# Altium schematic sheet CP2102_UART.SchDoc: CP2102_UART
size A4; Author: LanTruong; CompanyName: Gremsy J.S.C; Organization: Altium Limited; Address1: 152-154 Street No. 02, Van Phuc Residential City,; Address2: Hiep Binh Phuoc Ward, Thu Duc City, HCM City,; Address3: Viet Nam; DocumentNumber: 002; Revision: A; SheetNumber: 2; SheetTotal: 2
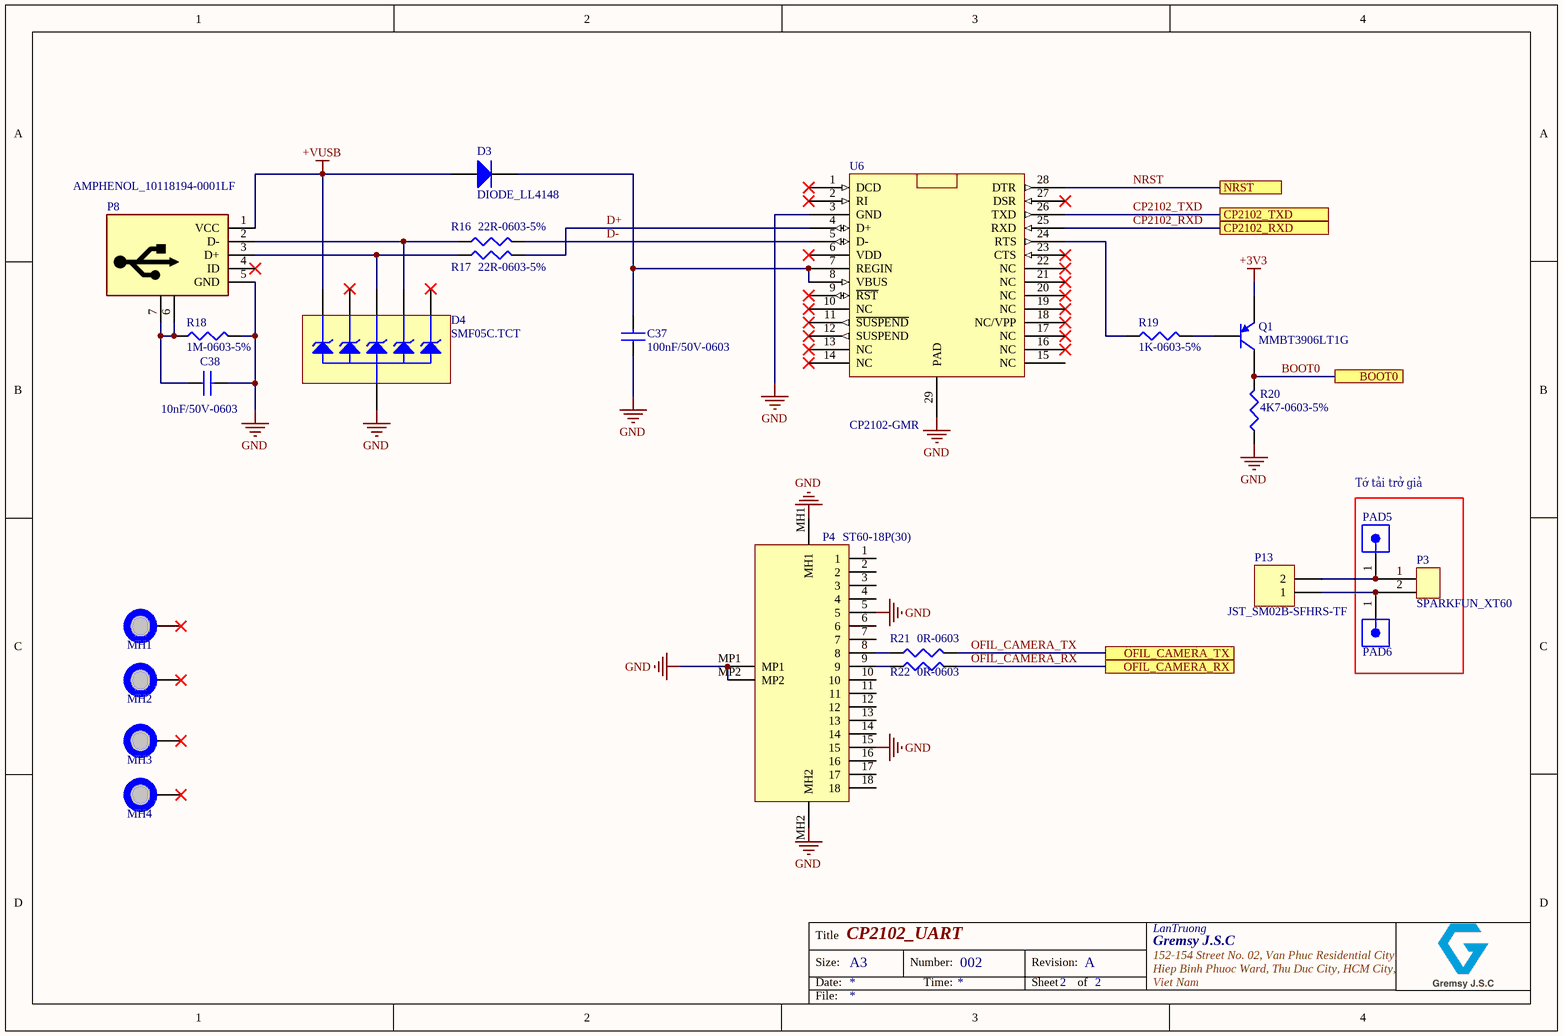
[diagram p0: CP2102_UART.SchDoc]

## Parts
C37  100nF/50V-0603  [CAP0603]
C38  10nF/50V-0603  [CAP0603]
D3  DIODE_LL4148  [SOD80]
D4  SMF05C.TCT  [SC-88]
MH1  MH_3MMC_2.1MMD  [MH_3MMD_2.1MMD]  (value not drawn)  (no BOM)
MH2  MH_3MMC_2.1MMD  [MH_3MMD_2.1MMD]  (value not drawn)  (no BOM)
MH3  MH_3MMC_2.1MMD  [MH_3MMD_2.1MMD]  (value not drawn)  (no BOM)
MH4  MH_3MMC_2.1MMD  [MH_3MMD_2.1MMD]  (value not drawn)  (no BOM)
P3  SPARKFUN_XT60  [XT60_MALE_RA]
P4  ST60-18P(30)  [ST6018P30]
P8  AMPHENOL_10118194-0001LF  [USB-B-Micro_10118194-0001LF]
P13  JST_SM02B-SFHRS-TF  [JST_M02B-SFHRS-TF(LF)(SN)]
PAD5  PAD_2.5MM_1.5MM  [PAD_2.5MM_1.5MM_HOLE]  (value not drawn)  (no BOM)
PAD6  PAD_2.5MM_1.5MM  [PAD_2.5MM_1.5MM_HOLE]  (value not drawn)  (no BOM)
Q1  MMBT3906LT1G  [SOT23]
R16  22R-0603-5%  [RES0603]
R17  22R-0603-5%  [RES0603]
R18  1M-0603-5%  [RES0603]
R19  1K-0603-5%  [RES0603]
R20  4K7-0603-5%  [RES0603]
R21  0R-0603  [RES0603]
R22  0R-0603  [RES0603]
U6  CP2102-GMR  [QFN28-Pitch 0.5 mm]

## Blocks framed on the sheet
Tớ tải trở giả: P3 PAD5 PAD6

## Ports
BOOT0, CP2102_RXD, CP2102_TXD, NRST, OFIL_CAMERA_RX, OFIL_CAMERA_TX

## Nets
+3V3: Q1.2(E)
+VUSB: D3.1(A) D4.1 P8.1(VCC)
GND: C37.1 C38.2 D4.2 P4.5 P4.15 P4.MH1 P4.MH2 P4.MP1 P4.MP2 P8.5(GND) R18.2 R20.1 U6.3(GND) U6.29(PAD)
BOOT0: Q1.3(C) R20.2 ; port BOOT0
CP2102_RXD: U6.25(RXD) ; port CP2102_RXD
CP2102_TXD: U6.26(TXD) ; port CP2102_TXD
D+: R17.2 U6.4(D+)
D-: R16.2 U6.5(D-)
NRST: U6.28(DTR) ; port NRST
OFIL_CAMERA_RX: R22.2 ; port OFIL_CAMERA_RX
OFIL_CAMERA_TX: R21.2 ; port OFIL_CAMERA_TX
NetC37_2: C37.2 D3.2(K) U6.7(REGIN) U6.8(VBUS)
NetC38_1: C38.1 P8.6(SHIELD) P8.7(SHIELD) R18.1
NetD4_4: D4.4 P8.3(D+) R17.1
NetD4_5: D4.5 P8.2(D-) R16.1
NetP3_1: P3.1 P13.2 PAD5.1
NetP3_2: P3.2 P13.1 PAD6.1
NetP4_8: P4.8 R21.1
NetP4_9: P4.9 R22.1
NetQ1_1: Q1.1(B) R19.2
NetR19_1: R19.1 U6.24(RTS)

Not connected (* = marked no-connect by the designer): D4 3* 6*; MH1 1*; MH2 1*; MH3 1*; MH4 1*; P4 1 2 3 4 6 7 10 11 12 13 14 16 17 18; P8 4(ID)*; U6 1(DCD)* 2(RI)* 6(VDD)* 9(~{RST})* 10(NC)* 11(~{SUSPEND})* 12(SUSPEND)* 13(NC)* 14(NC)* 15(NC) 16(NC)* 17(NC)* 18(NC/VPP)* 19(NC)* 20(NC)* 21(NC)* 22(NC)* 23(CTS)* 27(DSR)*

## Notes on the sheet
- Title
- Size:
- Date:
- A3
- Number:
- Time:
- Revision:
- Sheet
- of
- File:

## Library data of the parts
C37 = CAP_100nF/50V-0603-10%: CAP CER 0.1UF 50V X7R 0603; Manufacturer 1: Yageo; MfrP/N: CC0603KRX7R9BB104; Tolerance: ±10%; Value: 100nF; GremsyP/N: 102-100n-005-0; Supplier 1: Digi-Key; Supplier Part Number 1: 311-1344-1-ND; Voltage - Rated: 50V; Package / Case: 0603 (1608 Metric); ComponentLink1URL: http://www.yageo.com/documents/recent/UPY-GPHC_X7R_6.3V-to-50V_18.pdf; ComponentLink1Description: http://www.yageo.com/documents/recent/UPY-GPHC_X7R_6.3V-to-50V_18.pdf
C38 = CAP_10nF/50V-0603-10%: CAP CER 10000PF 50V X7R 0603; Manufacturer 1: Yageo; MfrP/N: CC0603KRX7R9BB103; Tolerance: ±10%; Value: 10nF; GremsyP/N: 102-10n-0030; Supplier 1: Digi-Key; Supplier Part Number 1: 311-1085-1-ND; Voltage - Rated: 50V; Package / Case: 0603 (1608 Metric); ComponentLink1URL: http://www.yageo.com/documents/recent/UPY-GPHC_X7R_6.3V-to-50V_18.pdf; ComponentLink1Description: http://www.yageo.com/documents/recent/UPY-GPHC_X7R_6.3V-to-50V_18.pdf
D3 = DIODE-RECTIFIER_LL4148: DIODE GEN PURP 100V 200MA SOD80; Manufacturer: Fairchild/ON Semiconductor; MfrP/N: LL4148; Diode Type: Standard; Voltage - Forward (Vf) (Max) @ If: 1V @ 10mA; Speed: Small Signal =< 200mA (Io), Any Speed; Current - Reverse Leakage @ Vr: 25nA @ 20V; Capacitance @ Vr, F: 4pF @ 0V, 1MHz; GremsyP/N: 104-RECT-002-0; Supplier 1: Digi-Key; RoHS: RoHS Compliant; Category: Discrete Semiconductor Products; Stock 1: 494912; Pricing 1: 1=0.1, 10=0.095, 100=0.0518, 500=0.03188, 1000=0.02174 (USD); Packaging: Cut Tape (CT); Part Status: Active; Current - Average Rectified (Io): 200mA; Mounting Type: Surface Mount; Package / Case: DO-213AC, MINI-MELF, SOD-80; Supplier Device Package: SOD-80; Operating Temperature - Junction: -55°C ~ 175°C; ComponentLink1URL: https://www.fairchildsemi.com/datasheets/LL/LL4148.pdf; ComponentLink1Description: https://www.fairchildsemi.com/datasheets/LL/LL4148.pdf; Supplier Part Number 1: LL4148FSCT-ND
D4 = DIODE-ESD_SMF05C.TCT: TVS DIODE 5VWM 12.5VC SC70-6; Manufacturer 1: Semtech Corporation; Category 1: Circuit Protection; Type: Zener; Voltage - Reverse Standoff (Typ): 5V (Max); Voltage - Breakdown (Min): 6V; Voltage - Clamping (Max) @ Ipp: 12.5V; Current - Peak Pulse (10/1000µs): 8A (8/20µs); Power - Peak Pulse: 100W; Power Line Protection: No; Capacitance @ Frequency: 130pF @ 1MHz; GremsyP/N: 104-ESD-010-0; Supplier 1: Digi-Key; Supplier Part Number 1: SMF05CCT-ND; MfrP/N: SMF05C.TCT; RoHS 1: RoHS Compliant; Description 1: TVS DIODE 5VWM 12.5VC SC70-6; Stock 1: 35242; Pricing 1: 1=0.87, 10=0.757, 25=0.6704, 100=0.584, 250=0.50832, 500=0.4326, 1000=0.34608 (USD); Packaging: Cut Tape (CT); Part Status: Active; Applications: General Purpose; Operating Temperature: -55°C ~ 125°C (TJ); Mounting Type: Surface Mount; Package / Case: 6-TSSOP, SC-88, SOT-363; Supplier Device Package: SC-70-6; ComponentLink1URL: http://www.semtech.com/images/datasheet/smf05c.pdf; ComponentLink1Description: http://www.semtech.com/images/datasheet/smf05c.pdf; Manufacturer Part Number: SMF05C.TCT
MH1-MH4 = MH_3MMC_2.1MMD: Mounting Hole 3mm Diameter, 2.1mm Drill
P3 = CON-SPARKFUN_XT60: CON XT-60, MALE PIN, THROUGH HOLE, 500V, 30A; Manufacturer: SparkFun Electronics; GremsyP/N: 106-SPARKFUN-001; MfrP/N: XT-60
P4 = CON-HIROSE_ST60-18P(30): HEADER 18POS PITCH 0.5MM, SMD, ST, FEMALE; Manufacturer 1: Hirose; Description 1: Interface Connectors for Portable Terminal Devices, -30 to 80 ℃, RoHS; Category 1: Connectors; Connector Type: Receptacle,Non-Gendered; Number of Positions: 18; Gender: Receptacle; Current Rating: 500mA; Pitch: 0.02inch; Supplier 1: Digi-Key; Supplier Part Number 1: H125265CT-ND; Manufacturer Part Number 1: ST60-18P(30); RoHS 1: Yes; Stock 1: 33582; Pricing 1: 1=1.60000, 10=1.45500, 25=1.36640, 50=1.30680, 100=1.24740, 250=1.12860, 500=1.03950 (USD); Mount: Surface Mount; Number of Pins: 18; Color: Black; Contact Material: Copper Alloy; Contact Plating: Gold; Packaging: Tape and Reel; Number of Rows: 1; Termination: Solder; REACH SVHC: Unknown; Flammability Rating: UL94 V-0; Lead Free: Lead Free; RoHS Compliant: Yes; ComponentLink1URL: http://www.farnell.com/datasheets/691909.pdf?src-supplier=Element14; ComponentLink1Description: http://www.farnell.com/datasheets/691909.pdf?src-supplier=Element14; ComponentLink2URL: https://www.hirose.com/product/en/download_file/key_name/ST/category/Catalog/doc_file_id/49740/?file_category_id=4&item_id=161&is_series=1&src-supplier=Digi-Key; ComponentLink2Description: https://www.hirose.com/product/en/download_file/key_name/ST/category/Catalog/doc_file_id/49740/?file_category_id=4&item_id=161&is_series=1&src-supplier=Digi-Key
P8 = CON-AMPHENOL_10118194-0001LF: USB2.0 MICRO_5POS-RA-SMD-F-AM, FEMALE; Manufacturer 1: Amphenol FCI; Description 1: CONN USB MICRO B RECPT SMT R/A; Category 1: Connectors, Interconnects; Connector Type: USB - micro B; Number of Contacts: 5; Gender: Receptacle; GremsyP/N: 106-AMPHENOL-008; Number of Ports: 1; Current Rating: 1.8A per Contact; Voltage - Rated: 100VAC; Shielding: Shielded; Supplier 1: Digi-Key; Supplier Part Number 1: 609-4618-1-ND; MfrP/N: 10118194-0001LF; RoHS 1: RoHS Compliant; Stock 1: 208581; Pricing 1: 1=0.46, 10=0.437, 25=0.3744, 50=0.318, 100=0.3056, 250=0.27444, 500=0.26196 (USD); Packaging: Cut Tape (CT); Part Status: Active; Specifications: USB 2.0; Mounting Type: Surface Mount, Right Angle; Through Hole; Mounting Feature: Horizontal; Termination: Solder; Features: Solder Retention; Operating Temperature: -30°C ~ 80°C; Contact Finish: Gold; Shell/Shielding Material: Steel, Stainless; ComponentLink1URL: http://portal.fciconnect.com/Comergent//fci/drawing/10118194.pdf; ComponentLink1Description: http://portal.fciconnect.com/Comergent//fci/drawing/10118194.pdf
P13 = CON-JST_SM02B-SFHRS-TF: PWR_2POS-P1.8-RA-SMD-M; Manufacturer: JST; MfrP/N: SM02B-SFHRS-TF(LF)(SN); Number of Positions: 2; Gender: Male; Connector Type: Male Pin; Pitch: 0.071inch; GremsyP/N: 106-JST-039; Supplier 1: Digi-Key; Stock 1: 73385; Pricing 1: 1=0.7, 10=0.653, 100=0.5006, 500=0.4353, 1000=0.3591 (USD); Mount: Surface Mount; Colour: Red; Contact Material: Copper; Contact Plating: Tin; Number of Rows: 1; Packaging: Cut Tape; Fastening Type: Detent; Number of Contacts: 2; REACH SVHC: Unknown; Lead Free: Lead Free; Supplier Part Number 1: 455-2524-6-ND; Termination: Solder
PAD5 PAD6 = PAD_2.5MMC_1.5MMD_HOLE
Q1 = TRNS-PNP_MMBT3906LT1G: TRANS PNP 40V 0.2A SOT23; Manufacturer 1: ON Semiconductor; Manufacturer Size Code: A; Category 1: Discrete Semiconductor Products; Current - Collector (Ic) (Max): 200mA; Vce Saturation (Max) @ Ib, Ic: 400mV @ 5mA, 50mA; DC Current Gain (hFE) (Min) @ Ic, Vce: 100 @ 10mA, 1V; Power - Max: 300mW; Frequency - Transition: 250MHz; Description 2: CAP TANT 10UF 10V 10% 1206; Category 2: Capacitors; Capacitance: 10µF; Tolerance: ±10%; Voltage - Rated: 10V; Type: Molded; ESR (Equivalent Series Resistance): 2 Ohm; GremsyP/N: 109-PNP-001-0; Supplier 1: Digi-Key; Supplier Part Number 1: MMBT3906LT1GOSDKR-ND; MfrP/N: MMBT3906LT1G; RoHS 1: RoHS Compliant; Description 1: TRANS PNP 40V 0.2A SOT23; Stock 1: 104972; Pricing 1: 1=0.11, 10=0.105, 100=0.0569, 500=0.03504, 1000=0.02389 (USD); Packaging: Digi-Reel®; Part Status: Active; Transistor Type: PNP; Voltage - Collector Emitter Breakdown (Max): 40V; Current - Collector Cutoff (Max): -; Operating Temperature: -55°C ~ 150°C (TJ); Mounting Type: Surface Mount; Package / Case: TO-236-3, SC-59, SOT-23-3; Supplier Device Package: SOT-23-3 (TO-236); ComponentLink1URL: http://www.onsemi.com/pub_link/Collateral/MMBT3906LT1-D.PDF; ComponentLink1Description: http://www.onsemi.com/pub_link/Collateral/MMBT3906LT1-D.PDF; Supplier 2: Digi-Key; Supplier Part Number 2: 718-1969-1-ND; Manufacturer 2: Vishay Sprague; Manufacturer Part Number 2: 593D106X9010A2TE3; RoHS 2: RoHS Compliant; Stock 2: 5789; Pricing 2: 1=0.5, 10=0.344, 100=0.2065, 500=0.15486, 1000=0.13077 (USD); Lifetime @ Temp.: -; Size / Dimension: 0.126" L x 0.063" W (3.20mm x 1.60mm); Height - Seated (Max): 0.071" (1.80mm); Lead Spacing: -; Features: General Purpose; Failure Rate: -; ComponentLink2URL: http://www.vishay.com/docs/40005/593d.pdf; ComponentLink2Description: http://www.vishay.com/docs/40005/593d.pdf; Manufacturer Part Number: MMBT3906LT1G
R16 R17 = RES_22R-0603-5%: RES 22 OHM 5% 1/10W 0603; Manufacturer 1: Yageo; MfrP/N: RC0603JR-0722RL; Value: 22R; GremsyP/N: 101-22R-002-0; Supplier 1: Digi-Key; Supplier Part Number 1: 311-22GRCT-ND; Package / Case: 0603 (1608 Metric); Tolerance: ±5%
R18 = RES_1M-0603-5%: RES 1M OHM 5% 1/10W 0603; Manufacturer 1: Yageo; MfrP/N: RC0603JR-071ML; GremsyP/N: 101-1M-002-0; Supplier 1: Digi-Key; Supplier Part Number 1: 311-1.0MGRCT-ND; Resistance (Ohms): 1M; Tolerance: ±5%; Package / Case: 0603 (1608 Metric); ComponentLink1URL: http://www.yageo.com/documents/recent/PYu-RC_Group_51_RoHS_L_7.pdf; ComponentLink1Description: http://www.yageo.com/documents/recent/PYu-RC_Group_51_RoHS_L_7.pdf; Value: 1M
R19 = RES_1K-0603-5%: RES 1K OHM 5% 1/10W 0603; Manufacturer 1: Yageo; MfrP/N: RC0603JR-071KL; GremsyP/N: 101-1K-003-0; Supplier 1: Digi-Key; Supplier Part Number 1: 311-1.0KGRCT-ND; Resistance (Ohms): 1k; Tolerance: ±5%; Package / Case: 0603 (1608 Metric); ComponentLink1URL: http://www.yageo.com/documents/recent/PYu-RC_Group_51_RoHS_L_7.pdf; ComponentLink1Description: http://www.yageo.com/documents/recent/PYu-RC_Group_51_RoHS_L_7.pdf; Value: 1K
R20 = RES_4K7-0603-5%: RES 4.7K OHM 5% 1/10W 0603; Manufacturer: Yageo; MfrP/N: RC0603JR-074K7L; Value: 4K7; GremsyP/N: 101-4K7-002-0; Supplier 1: Digi-Key; Tolerance: ±5%; Package / Case: 0603 (1608 Metric); ComponentLink1URL: http://www.yageo.com/documents/recent/PYu-RC_Group_51_RoHS_L_7.pdf; ComponentLink1Description: http://www.yageo.com/documents/recent/PYu-RC_Group_51_RoHS_L_7.pdf; Supplier Part Number 1: 311-4.7KGRCT-ND
R21 R22 = RES_0R-0603: RES 0 OHM JUMPER 1/10W 0603; Manufacturer 1: Yageo; MfrP/N: RC0603JR-070RL; Value: 0R; GremsyP/N: 101-0R-002-0; Supplier 1: Digi-Key; Supplier Part Number 1: 311-0.0GRCT-ND; Tolerance: Jumper; Package / Case: 0603 (1608 Metric); ComponentLink1URL: http://www.yageo.com/documents/recent/PYu-RC_Group_51_RoHS_L_7.pdf; ComponentLink1Description: http://www.yageo.com/documents/recent/PYu-RC_Group_51_RoHS_L_7.pdf
U6 = CP2102-GMR: IC USB-TO-UART BRIDGE 28VQFN; Manufacturer 1: Silicon Labs; Category 1: Integrated Circuits (ICs); Protocol: USB; Function: Bridge, USB to UART; Interface: UART; Standards: USB 2.0; Voltage - Supply: 3 V ~ 3.6 V; Current - Supply: 20mA; Supplier 1: Digi-Key; Supplier Part Number 1: 336-1160-1-ND; Manufacturer Part Number 1: CP2102-GMR; RoHS 1: RoHS Compliant; Description 1: IC USB-TO-UART BRIDGE 28VQFN; Stock 1: 39071; Pricing 1: 1=2.88, 25=2.7736, 100=2.6668 (USD); Packaging: Cut Tape (CT); Part Status: Active; Operating Temperature: -40°C ~ 85°C; Package / Case: 28-VFQFN Exposed Pad; Supplier Device Package: 28-QFN (5x5); ComponentLink1URL: http://www.silabs.com/documents/public/data-sheets/CP2102-9.pdf; ComponentLink1Description: http://www.silabs.com/documents/public/data-sheets/CP2102-9.pdf